# Altium schematic sheet CANFD.SchDoc: CANFD OF CPU
size A4; DrawnBy: ThanhQuoc; Revision: V01; SheetNumber: 16; SheetTotal: 21; Project: RV1126 CAMERA BOARD DESIGN
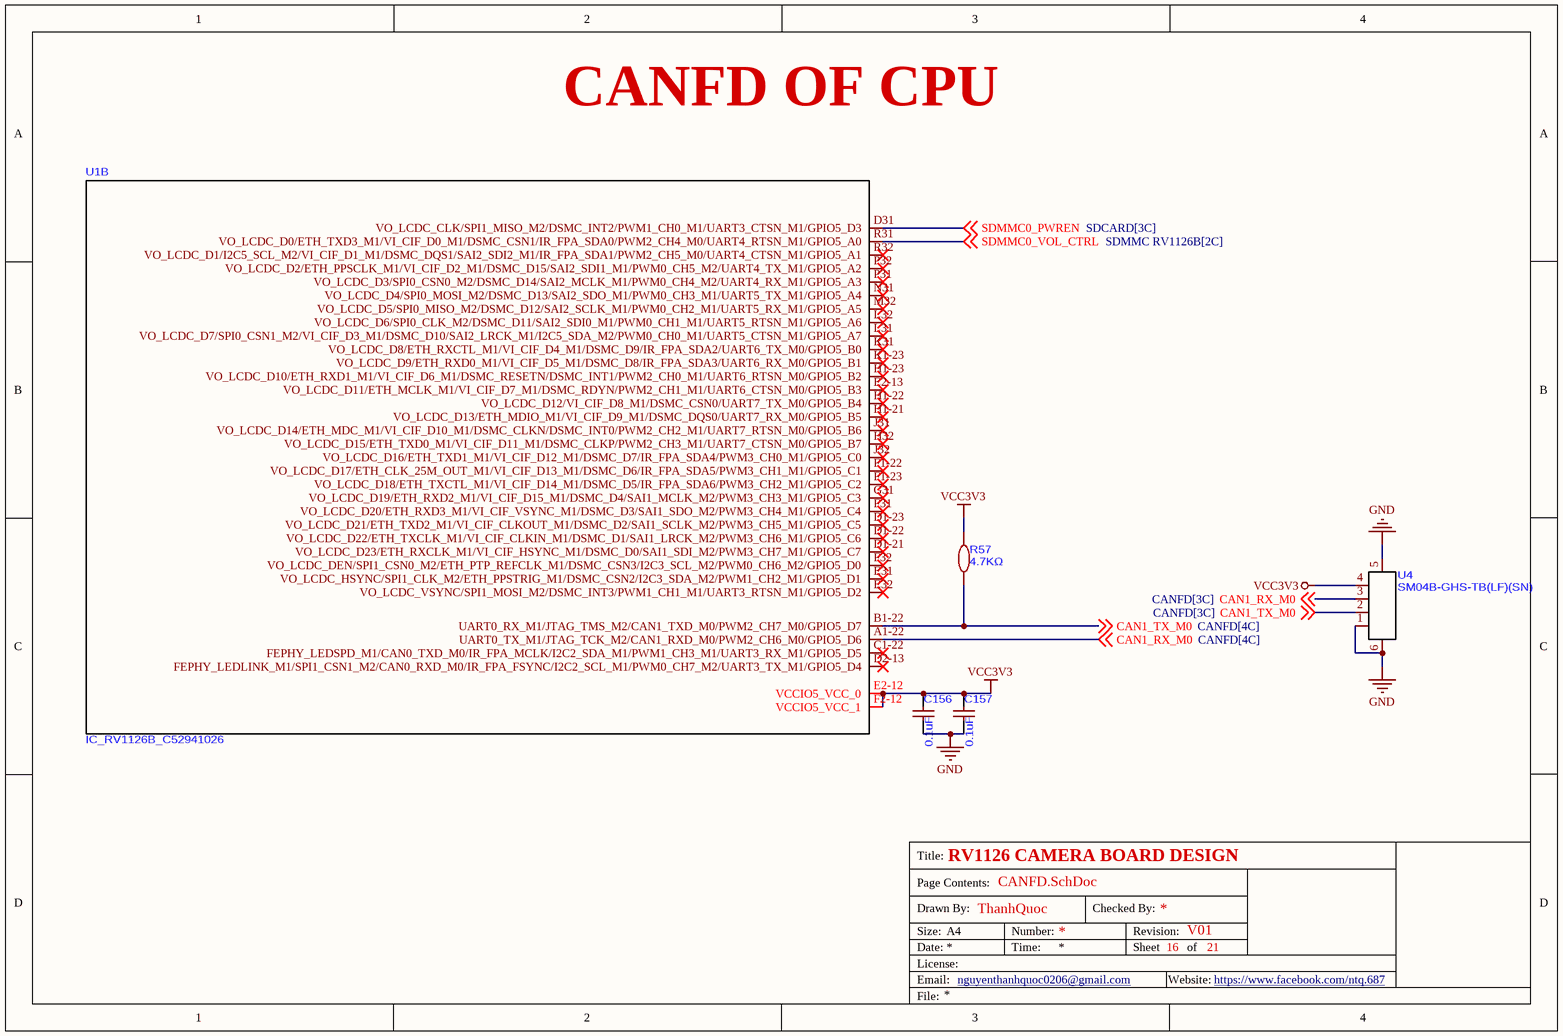
[diagram p0: CANFD.SchDoc]

## Parts
C156  0.1uF  [C0201]
C157  0.1uF  [C0201]
R57  4.7KΩ  [R0201]
U1  IC_RV1126B_C52941026  [CCSP-491_L14.0-W14.0-TL_RV1126B]  (part B of 18)
U4  SM04B-GHS-TB(LF)(SN)  [CONN-SMD_4P-P1.25_SM04B-GHS-TB-LF-SN]

## Nets
GND: C156.1 C157.1 U4.1 U4.5 U4.6
VCC3V3: C156.2 C157.2 R57.2 U1.E2-12(VCCIO5_VCC_0) U1.F2-12(VCCIO5_VCC_1) U4.4
CAN1_RX_M0: U1.A1-22(UART0_TX_M1/JTAG_TCK_M2/CAN1_RXD_M0/PWM2_CH6_M0/GPIO5_D6) U4.3 ; off-sheet CAN1_RX_M0
CAN1_TX_M0: R57.1 U1.B1-22(UART0_RX_M1/JTAG_TMS_M2/CAN1_TXD_M0/PWM2_CH7_M0/GPIO5_D7) U4.2 ; off-sheet CAN1_TX_M0
SDMMC0_PWREN: U1.D31(VO_LCDC_CLK/SPI1_MISO_M2/DSMC_INT2/PWM1_CH0_M1/UART3_CTSN_M1/GPIO5_D3) ; off-sheet SDMMC0_PWREN
SDMMC0_VOL_CTRL: U1.R31(VO_LCDC_D0/ETH_TXD3_M1/VI_CIF_D0_M1/DSMC_CSN1/IR_FPA_SDA0/PWM2_CH4_M0/UART4_RTSN_M1/GPIO5_A0) ; off-sheet SDMMC0_VOL_CTRL

Not connected (* = marked no-connect by the designer): U1 C1-22(FEPHY_LEDSPD_M1/CAN0_TXD_M0/IR_FPA_MCLK/I2C2_SDA_M1/PWM1_CH3_M1/UART3_RX_M1/GPIO5_D5)* D1-21(VO_LCDC_D23/ETH_RXCLK_M1/VI_CIF_HSYNC_M1/DSMC_D0/SAI1_SDI_M2/PWM3_CH7_M1/GPIO5_C7)* D1-22(VO_LCDC_D22/ETH_TXCLK_M1/VI_CIF_CLKIN_M1/DSMC_D1/SAI1_LRCK_M2/PWM3_CH6_M1/GPIO5_C6)* D1-23(VO_LCDC_D21/ETH_TXD2_M1/VI_CIF_CLKOUT_M1/DSMC_D2/SAI1_SCLK_M2/PWM3_CH5_M1/GPIO5_C5)* D2-13(FEPHY_LEDLINK_M1/SPI1_CSN1_M2/CAN0_RXD_M0/IR_FPA_FSYNC/I2C2_SCL_M1/PWM0_CH7_M2/UART3_TX_M1/GPIO5_D4)* E2-13(VO_LCDC_D11/ETH_MCLK_M1/VI_CIF_D7_M1/DSMC_RDYN/PWM2_CH1_M1/UART6_CTSN_M0/GPIO5_B3)* E31(VO_LCDC_HSYNC/SPI1_CLK_M2/ETH_PPSTRIG_M1/DSMC_CSN2/I2C3_SDA_M2/PWM1_CH2_M1/GPIO5_D1)* E32(VO_LCDC_VSYNC/SPI1_MOSI_M2/DSMC_INT3/PWM1_CH1_M1/UART3_RTSN_M1/GPIO5_D2)* F1-22(VO_LCDC_D17/ETH_CLK_25M_OUT_M1/VI_CIF_D13_M1/DSMC_D6/IR_FPA_SDA5/PWM3_CH1_M1/GPIO5_C1)* F1-23(VO_LCDC_D18/ETH_TXCTL_M1/VI_CIF_D14_M1/DSMC_D5/IR_FPA_SDA6/PWM3_CH2_M1/GPIO5_C2)* F31(VO_LCDC_D20/ETH_RXD3_M1/VI_CIF_VSYNC_M1/DSMC_D3/SAI1_SDO_M2/PWM3_CH4_M1/GPIO5_C4)* F32(VO_LCDC_DEN/SPI1_CSN0_M2/ETH_PTP_REFCLK_M1/DSMC_CSN3/I2C3_SCL_M2/PWM0_CH6_M2/GPIO5_D0)* G31(VO_LCDC_D19/ETH_RXD2_M1/VI_CIF_D15_M1/DSMC_D4/SAI1_MCLK_M2/PWM3_CH3_M1/GPIO5_C3)* H1-21(VO_LCDC_D13/ETH_MDIO_M1/VI_CIF_D9_M1/DSMC_DQS0/UART7_RX_M0/GPIO5_B5)* H1-22(VO_LCDC_D12/VI_CIF_D8_M1/DSMC_CSN0/UART7_TX_M0/GPIO5_B4)* H1-23(VO_LCDC_D10/ETH_RXD1_M1/VI_CIF_D6_M1/DSMC_RESETN/DSMC_INT1/PWM2_CH0_M1/UART6_RTSN_M0/GPIO5_B2)* H32(VO_LCDC_D15/ETH_TXD0_M1/VI_CIF_D11_M1/DSMC_CLKP/PWM2_CH3_M1/UART7_CTSN_M0/GPIO5_B7)* J31(VO_LCDC_D14/ETH_MDC_M1/VI_CIF_D10_M1/DSMC_CLKN/DSMC_INT0/PWM2_CH2_M1/UART7_RTSN_M0/GPIO5_B6)* J32(VO_LCDC_D16/ETH_TXD1_M1/VI_CIF_D12_M1/DSMC_D7/IR_FPA_SDA4/PWM3_CH0_M1/GPIO5_C0)* K1-23(VO_LCDC_D9/ETH_RXD0_M1/VI_CIF_D5_M1/DSMC_D8/IR_FPA_SDA3/UART6_RX_M0/GPIO5_B1)* K31(VO_LCDC_D8/ETH_RXCTL_M1/VI_CIF_D4_M1/DSMC_D9/IR_FPA_SDA2/UART6_TX_M0/GPIO5_B0)* L31(VO_LCDC_D7/SPI0_CSN1_M2/VI_CIF_D3_M1/DSMC_D10/SAI2_LRCK_M1/I2C5_SDA_M2/PWM0_CH0_M1/UART5_CTSN_M1/GPIO5_A7)* L32(VO_LCDC_D6/SPI0_CLK_M2/DSMC_D11/SAI2_SDI0_M1/PWM0_CH1_M1/UART5_RTSN_M1/GPIO5_A6)* M32(VO_LCDC_D5/SPI0_MISO_M2/DSMC_D12/SAI2_SCLK_M1/PWM0_CH2_M1/UART5_RX_M1/GPIO5_A5)* N31(VO_LCDC_D4/SPI0_MOSI_M2/DSMC_D13/SAI2_SDO_M1/PWM0_CH3_M1/UART5_TX_M1/GPIO5_A4)* P31(VO_LCDC_D3/SPI0_CSN0_M2/DSMC_D14/SAI2_MCLK_M1/PWM0_CH4_M2/UART4_RX_M1/GPIO5_A3)* P32(VO_LCDC_D2/ETH_PPSCLK_M1/VI_CIF_D2_M1/DSMC_D15/SAI2_SDI1_M1/PWM0_CH5_M2/UART4_TX_M1/GPIO5_A2)* R32(VO_LCDC_D1/I2C5_SCL_M2/VI_CIF_D1_M1/DSMC_DQS1/SAI2_SDI2_M1/IR_FPA_SDA1/PWM2_CH5_M0/UART4_CTSN_M1/GPIO5_A1)*

## Notes on the sheet
- Title:
- Drawn By:
- Page Contents:
- Checked By:
- Size:
- Date:
- File:
- License:
- Email:
- A4
- nguyenthanhquoc0206@gmail.com
- Number:
- Time:
- Revision:
- Sheet
- Website:
- of
- https://www.facebook.com/ntq.687

## Library data of the parts
C156 C157 = CAP_100nF-6.3V-10%-0201_1: 0.1uF ±10% 6.3V Ceramic Capacitor X5R 0201
R57 = RES_4.7K-50mW-1%-0201: RES 4.7kΩ ±1% 50mW 0201; ComponentLink1Description: LCSC; ComponentLink1URL: https://www.lcsc.com/product-detail/C295718.html?s_z=n_q_t_120%2520OHM&spm=wm.fly.bg.5.xh___wm.ssy.tc.1.tz&lcsc_vid=EwRWBFZSQVIPVFdUTlJfVldeFFRYUFQAElRYBFRRE1MxVlNeRFZeU1BfTlBYVzsOAxUeFF5JWBYZEEoKFBINSQcJGk4eFQsCAgIaSgADAwAHC0slRVhcV1ZTT08GEwkK
U4 = SM04B-GHS-TB(LF)(SN): CONN HEADER SMD R/A 4POS 1.25mm